# EAGLE design sensor (EAGLE 7.7.0)
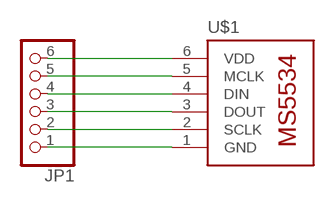
[diagram p0: schematic, sheet 1]

## Parts
JP1  PINHD-1X6  [1X06]
U$1  MS5534  [MS5534C]

## Nets
N$1: JP1.6 U$1.6(VDD)
N$2: JP1.5 U$1.5(MCLK)
N$3: JP1.4 U$1.4(DIN)
N$4: JP1.3 U$1.3(DOUT)
N$5: JP1.2 U$1.2(SCLK)
N$6: JP1.1 U$1.1(GND)

## Library data of the parts
JP1 = pinhead:PINHD-1X6: PIN HEADER
U$1 = ms5534:MS5534: MS5534C Barometer Module 3-wire serial interface 1 system clock line (32.768 kHz) 10 - 1100 mbar absolute pressure range Supply voltage 2.2 V to 3.6 V

## Board
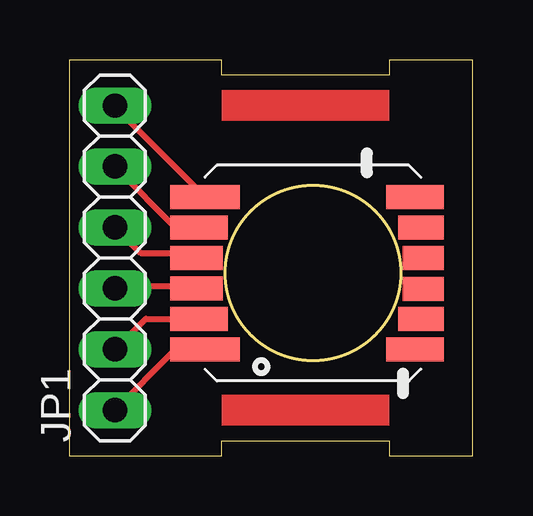
[diagram p1: board, top side]
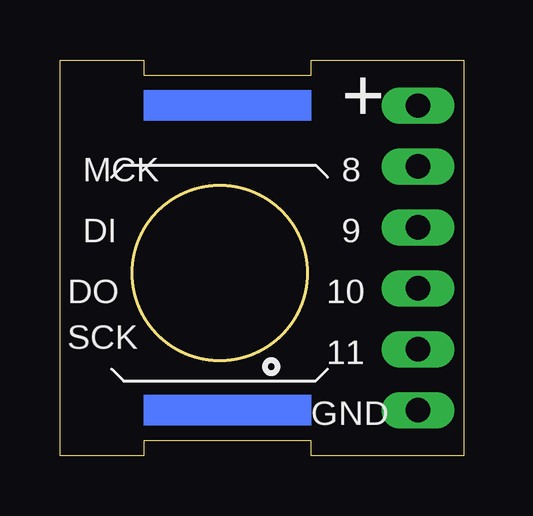
[diagram p2: board, bottom side, seen from below]

Size 16.82 x 16.51 mm. Coordinates in mm from the lower left corner, seen from the top.
Outline: 0,0 6.35,0 6.35,0.64 13.34,0.64 13.34,0 16.82,0 16.82,16.5 13.34,16.51 13.34,15.88 6.35,15.88 6.35,16.5 0,16.5 0,0
Copper layers (1*16): Top 0.035559375mm / dielectric 1.6mm / Bottom 0.035559375mm
Design rules "oshpark-2layer (1)": minimum track width 6mil, minimum drill 10mil, track to track 6mil, track to pad 6mil, pad to pad 6mil, via to via 6mil, smd to smd 6mil, copper to edge 15mil, drill to drill 6mil, minimum pad ring 5mil, minimum via ring 5mil, stop-mask expansion 2.5mil, vias tented up to drill 0mil, thermal gap 10mil

### Footprints (pad centres in the part's own frame; a part is rotated, then mirrored left to right if it is on the bottom)
1X06 = drill 1.016 long: 1 -6.35,0; 2 -3.81,0; 3 -1.27,0; 4 1.27,0; 5 3.81,0; 6 6.35,0
MS5534C = smd 2.9 x 1: 1 4.5,3.175; 6 4.5,-3.175 | smd 2.4 x 1: 2 4.75,1.905; 5 4.75,-1.905; NC@1 -4.25,3.175; NC@6 -4.25,-3.175 | smd 2.2 x 1: 3 4.85,0.635; 4 4.85,-0.635 | smd 1.9 x 1: NC@2 -4.5,1.905; NC@5 -4.5,-1.905 | smd 1.7 x 1: NC@3 -4.6,0.653; NC@4 -4.6,-0.635 | hole 7.3: 0,0

### Placement (x,y rotation side)
JP1  1.91,8.26 90 top
U$1  10.16,7.62 180 top

### Tracks (layer width: path | path; a pad name or v marks a point on that pad's centre or on a via)
N$1
  Top 0.254: U$1.6 5.49,10.97 2.06,14.4 JP1.6
N$2
  Top 0.254: U$1.5 5.26,9.6 4.34,9.6 2.06,11.89 JP1.5
N$3
  Top 0.254: JP1.4 2.97,8.46 5.26,8.46 U$1.4
N$4
  Top 0.254: U$1.3 5.26,7.09 2.06,7.09 JP1.3
N$5
  Top 0.254: U$1.2 3.2,5.71 2.06,4.57 JP1.2
N$6
  Top 0.254: JP1.1 4.34,4.34 5.49,4.34 U$1.1
(copper drawn outside any net)
  shapes: Bottom area x2, Top area x2

### Text on the board
bPlace: + | 8 | MCK | 9 | DI | 10 | DO | 11 | SCK | GND